# Altium schematic sheet Power Management.SchDoc
size A; SheetNumber: 4; SheetTotal: 7
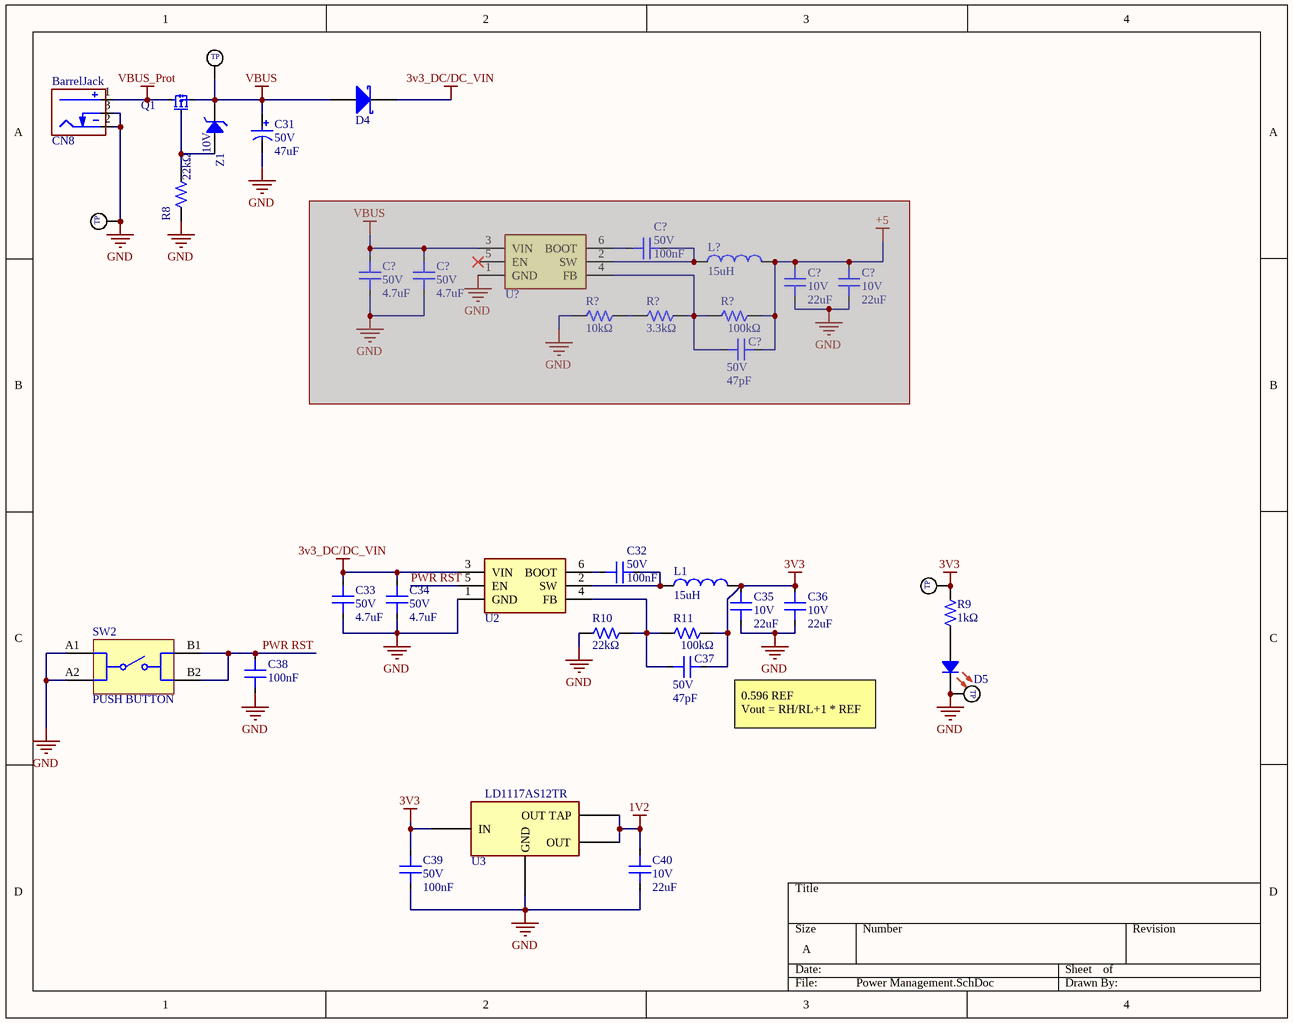
[diagram p0: Power Management.SchDoc]

## Parts
(Parts that share a designator on the sheet are numbered #1, #2 ... from top to bottom, then left to right.)
C31  Voltage Rating: 50V  Capacitance: 47uF  [CAP TH ALUM ELEC D6.30mm S2.50mm H11.00mm]  (hidden comment: CAP ALUM 47uF ±20% 50V TH)
C32  Voltage Rating: 50V  Capacitance: 100nF  [C_0603]  (hidden comment: CAP CER 100nF 50V X7R 0603)
C33  Voltage Rating: 50V  Capacitance: 4.7uF  [C_1206]  (hidden comment: CAP CER 4.7uF 50V X7R 1206)
C34  Voltage Rating: 50V  Capacitance: 4.7uF  [C_1206]  (hidden comment: CAP CER 4.7uF 50V X7R 1206)
C35  Voltage Rating: 10V  Capacitance: 22uF  [C_1206]  (hidden comment: CAP CER 22uF 10V X7R 1206)
C36  Voltage Rating: 10V  Capacitance: 22uF  [C_1206]  (hidden comment: CAP CER 22uF 10V X7R 1206)
C37  Voltage Rating: 50V  Capacitance: 47pF  [C_0603]  (hidden comment: CAP CER 47pF 50V C0G 0603)
C38  Capacitance: 100nF  [C_0603]  (hidden comment: CAP CER 100nF 50V X7R 0603)
C39  Voltage Rating: 50V  Capacitance: 100nF  [C_0603]  (hidden comment: CAP CER 100nF 50V X7R 0603)
C40  Voltage Rating: 10V  Capacitance: 22uF  [C_1206]  (hidden comment: CAP CER 22uF 10V X7R 1206)
C?#1  Voltage Rating: 50V  Capacitance: 100nF  [C_0603]  (hidden comment: CAP CER 100nF 50V X7R 0603)  (masked out: inside a compile mask, not in the netlist)
C?#2  Voltage Rating: 50V  Capacitance: 4.7uF  [C_1206]  (hidden comment: CAP CER 4.7uF 50V X7R 1206)  (masked out: inside a compile mask, not in the netlist)
C?#3  Voltage Rating: 50V  Capacitance: 4.7uF  [C_1206]  (hidden comment: CAP CER 4.7uF 50V X7R 1206)  (masked out: inside a compile mask, not in the netlist)
C?#4  Voltage Rating: 10V  Capacitance: 22uF  [C_1206]  (hidden comment: CAP CER 22uF 10V X7R 1206)  (masked out: inside a compile mask, not in the netlist)
C?#5  Voltage Rating: 10V  Capacitance: 22uF  [C_1206]  (hidden comment: CAP CER 22uF 10V X7R 1206)  (masked out: inside a compile mask, not in the netlist)
C?#6  Voltage Rating: 50V  Capacitance: 47pF  [C_0603]  (hidden comment: CAP CER 47pF 50V C0G 0603)  (masked out: inside a compile mask, not in the netlist)
CN8  CONN PWR JACK 2mm x 6.4mm TH R/A  [CONN_DC-POWER-JACK_TH_RA]  (value not drawn)
D4  DIODE SCHOTTKY 40V SOD-323  [SOD323]  (value not drawn)
D5  LED RED WATER CLEAR 0603 SMD  [LED_0603]  (value not drawn)
L1  Inductance: 15uH  [IND_SMD,4.7X4.7MM]  (hidden comment: FIXED IND 15uH 0.76A 149mΩ SMD,4.7x4.7mm)
L?  Inductance: 15uH  [IND_SMD,4.7X4.7MM]  (hidden comment: FIXED IND 15uH 0.76A 149mΩ SMD,4.7x4.7mm)  (masked out: inside a compile mask, not in the netlist)
Q1  MOSFET P-CH 30V 4A SOT-23  [SOT23]  (value not drawn)
R8  Resistance: 22kΩ  [R_0603]  (hidden comment: RES 22kΩ ±1% 100mW 0603)
R9  Resistance: 1kΩ  [R_0603]  (hidden comment: RES 1kΩ ±1% 100mW 0603)
R10  Resistance: 22kΩ  [R_0603]  (hidden comment: RES 22kΩ ±1% 100mW 0603)
R11  Resistance: 100kΩ  [R_0603]  (hidden comment: RES 100kΩ ±1% 100mW 0603)
R?#1  Resistance: 10kΩ  [R_0603]  (hidden comment: RES 10kΩ ±1% 100mW 0603)  (masked out: inside a compile mask, not in the netlist)
R?#2  Resistance: 3.3kΩ  [R_0603]  (hidden comment: RES 3.3kΩ ±1% 100mW 0603)  (masked out: inside a compile mask, not in the netlist)
R?#3  Resistance: 100kΩ  [R_0603]  (hidden comment: RES 100kΩ ±1% 100mW 0603)  (masked out: inside a compile mask, not in the netlist)
SW2  PUSH BUTTON  [Tact Switch 6X6X9.5MM]
TP1  TestPoint TH  [TESTPOINT_TH_MINIATURE]  (value not drawn)
TP2  TestPoint TH  [TESTPOINT_TH_MINIATURE]  (value not drawn)
TP3  TestPoint TH  [TESTPOINT_TH_MINIATURE]  (value not drawn)
TP4  TestPoint TH  [TESTPOINT_TH_MINIATURE]  (value not drawn)
U2  4.5-V to 28-V Input, 3-A Output, EMI-Friendly Synchronous Step-Down Converter  [TSOT-23-6]  (value not drawn)
U3  Low Dropout Fixed and Adjustable Positive Voltage Regulators  [SOT-223-4]  (value not drawn)
U?  4.5-V to 28-V Input, 3-A Output, EMI-Friendly Synchronous Step-Down Converter  [TSOT-23-6]  (value not drawn)  (masked out: inside a compile mask, not in the netlist)
Z1  Zener Voltage: 10V  [SOD123]  (hidden comment: DIODE ZENER 10V 500mW SOD-123)

## Nets
1V2: C40.2 U3.2(OUT) U3.4(OUT_TAP)
3V3: C35.2 C36.2 C37.2 C39.2 L1.2 R9.1 R11.2 TP3.1 U3.3(IN)
3v3_DC/DC_VIN: C33.1 C34.1 D4.2(K) U2.3(VIN)
GND: C31.2 C33.2 C34.2 C35.1 C36.1 C38.1 C39.1 C40.1 CN8.2(Outer) CN8.3(SW) D5.2 R8.1 R10.1 SW2.A1 SW2.A2 TP2.1 TP4.1 U2.1(GND) U3.1(GND)
VBUS: C31.1 D4.1(A) Q1.2(SOURCE) TP1.1 Z1.2
VBUS_Prot: CN8.1(Centre) Q1.3(DRAIN)
PWR RST: C38.2 SW2.B1 SW2.B2 U2.5(EN)
NetC32_1: C32.1 U2.6(BOOT)
NetC32_2: C32.2 L1.1 U2.2(SW)
NetC37_1: C37.1 R10.2 R11.1 U2.4(FB)
NetD5_1: D5.1 R9.2
NetQ1_1: Q1.1(GATE) R8.2 Z1.1

## Notes on the sheet
- 0.596 REF
  Vout = RH/RL+1 * REF
- (in symbol 5000) TP

## Library data of the parts
C31 = ERS1HM470E110T: 47uF 50V Aluminum Electrolytic Capacitors Through Hole,D6.3xL11mm 5000hrs@105℃; Manufacturer: AISHI; Symbol Path 1: Symbols\Standard.SchLib; Unit Price (USD): 0.0351; MPN: ERS1HM470E110T; LCSC Part #: C106665; Package: THROUGH HOLE,D6.3XL11MM; JLC Part Type: Extended; LCSC Stock: 162380; JLC Stock: 171488; MOQ: 20; Datasheet: https://datasheet.lcsc.com/datasheet/pdf/b0168805bce6925b8870af550341b247.pdf?productCode=C106665; URL: https://www.lcsc.com/product-detail/C106665.html; Status: ok; Tolerance: ±20%; Lifetime: 5000hrs@105℃; Subcategory: Aluminum Electrolytic Capacitors
C32 C39 C?#1 = C14663: 100nF ±10% 50V Ceramic Capacitor X7R 0603; Manufacturer: YAGEO; MPN: CC0603KRX7R9BB104; Symbol Path 1: Symbols\Standard.SchLib; Unit Price (USD): 0.0175; LCSC Part #: C14663; Package: 0603; JLC Part Type: Basic; LCSC Stock: 10701000; JLC Stock: 72739428; MOQ: 50; Datasheet: https://datasheet.lcsc.com/datasheet/pdf/23ccee80ee542e7cf156a772bb589942.pdf?productCode=C14663; URL: https://www.lcsc.com/product-detail/C14663.html; Status: ok; Tolerance: ±10%; TempCo: X7R
C33 C34 C?#2 C?#3 = C29823: 4.7uF ±10% 50V Ceramic Capacitor X7R 1206; Manufacturer: FH; MPN: 1206B475K500NT; Symbol Path 1: Symbols\Standard.SchLib; Unit Price (USD): 0.2723; LCSC Part #: C29823; Package: 1206; JLC Part Type: Basic; LCSC Stock: 428640; JLC Stock: 942034; MOQ: 10; Datasheet: https://datasheet.lcsc.com/datasheet/pdf/09fe2daf22580a99fa7fea93ccb20fb7.pdf?productCode=C29823; URL: https://www.lcsc.com/product-detail/C29823.html; Status: ok; Tolerance: ±10%; TempCo: X7R
C35 C36 C40 C?#4 C?#5 = C87996: 22uF ±10% 10V Ceramic Capacitor X7R 1206; Manufacturer: Samsung Electro-Mechanics; MPN: CL31B226KPHNNNE; Symbol Path 1: Symbols\Standard.SchLib; Unit Price (USD): 0.1794; LCSC Part #: C87996; Package: 1206; JLC Part Type: Extended; LCSC Stock: 223920; JLC Stock: 305356; MOQ: 5; Datasheet: https://datasheet.lcsc.com/datasheet/pdf/02336ea48ea44ca18c72517dd3cb7b47.pdf?productCode=C87996; URL: https://www.lcsc.com/product-detail/C87996.html; Status: ok; Tolerance: ±10%; TempCo: X7R
C37 C?#6 = C1671: 47pF ±5% 50V Ceramic Capacitor C0G 0603; Manufacturer: Samsung Electro-Mechanics; MPN: CL10C470JB8NNNC; Symbol Path 1: Symbols\Standard.SchLib; Unit Price (USD): 0.011; LCSC Part #: C1671; Package: 0603; JLC Part Type: Basic; LCSC Stock: 658700; JLC Stock: 1229214; MOQ: 100; Datasheet: https://datasheet.lcsc.com/datasheet/pdf/02336ea48ea44ca18c72517dd3cb7b47.pdf?productCode=C1671; URL: https://www.lcsc.com/product-detail/C1671.html; Status: ok; Tolerance: ±5%; TempCo: C0G
C38 = CC0603KRX7R9BB104: 100nF ±10% 50V Ceramic Capacitor X7R 0603; Manufacturer: YAGEO; Symbol Path 1: Symbols\Standard.SchLib; Unit Price (USD): 0.0175; Voltage Rating: 50V; MPN: CC0603KRX7R9BB104; LCSC Part #: C14663; Package: 0603; JLC Part Type: Basic; LCSC Stock: 10701000; JLC Stock: 72739428; MOQ: 50; Datasheet: https://datasheet.lcsc.com/datasheet/pdf/23ccee80ee542e7cf156a772bb589942.pdf?productCode=C14663; URL: https://www.lcsc.com/product-detail/C14663.html; Status: ok; Tolerance: ±10%; TempCo: X7R
CN8 = DC-005-A200: Power Barrel Connector Jack 2mm ID 6.4mm OD Through Hole, Right Angle; Manufacturer: XUNPU; Symbol Path 1: Symbols\Standard_CONN.SchLib; Unit Price (USD): 0.1442; MPN: DC-005-A200; LCSC Part #: C720557; Package: THROUGH HOLE; JLC Part Type: Extended; LCSC Stock: 71145; JLC Stock: 71145; MOQ: 5; Datasheet: https://datasheet.lcsc.com/datasheet/pdf/c2acc7caa29ac1d040564d55b702c9cb.pdf?productCode=C720557; URL: https://www.lcsc.com/product-detail/C720557.html; Status: ok
D4 = 1N5819WS: Diode 40V 1A Surface Mount SOD-323; Manufacturer: Guangdong Hottech; Symbol Path 1: Symbols\Standard.SchLib; Unit Price (USD): 0.0139; Forward Voltage: 600mV@1A; MPN: 1N5819WS; LCSC Part #: C191023; Package: SOD-323; JLC Part Type: Basic; LCSC Stock: 4984450; JLC Stock: 5626571; MOQ: 50; Datasheet: https://datasheet.lcsc.com/datasheet/pdf/c7a6590686b7be2f86b8eed4480e569c.pdf?productCode=C191023; URL: https://www.lcsc.com/product-detail/C191023.html; Status: ok; Voltage Rating: 40V; Current Rating: 1A; Subcategory: Schottky
D5 = XL-1608SURC-06: Red 625nm LED Indication - Discrete 2.3V 0603; Manufacturer: XINGLIGHT; Symbol Path 1: Symbols\Standard.SchLib; Unit Price (USD): 0.0035; Forward Current: 20mA; Luminous: 225mcd; MPN: XL-1608SURC-06; LCSC Part #: C965799; Package: 0603; JLC Part Type: Extended; LCSC Stock: 7400800; JLC Stock: 7400861; MOQ: 100; Datasheet: https://datasheet.lcsc.com/datasheet/pdf/8b84af6e65674f776ac713f2807c626a.pdf?productCode=C965799; URL: https://www.lcsc.com/product-detail/C965799.html; Status: ok; Colour: Red; Forward Voltage: 2.3V
L1 L? = XRRH4D28-150M: Manufacturer: XR; Symbol Path 1: Symbols\Standard.SchLib; Unit Price (USD): 0.1057; Tolerance: ±20%; Rated Current: 760mA; MPN: XRRH4D28-150M; LCSC Part #: C5351438; Package: SMD,4.7X4.7MM; JLC Part Type: Extended; LCSC Stock: 640; JLC Stock: 640; MOQ: 5; Datasheet: https://datasheet.lcsc.com/datasheet/pdf/86c679cf93a94dd1d57823f3427e60b9.pdf?productCode=C5351438; URL: https://www.lcsc.com/product-detail/C5351438.html; Status: ok; DC Resistance: 149mΩ
Q1 = AO3401A: 30V 4A Surface Mount SOT-23; Manufacturer: AOS; Symbol Path 1: Symbols\Standard.SchLib; Unit Price (USD): 0.0951; Rds: 47mΩ@10V;60mΩ@4.5V;85mΩ@2.5V; Vgs(th): 900mV; MPN: AO3401A; LCSC Part #: C15127; Package: SOT-23; JLC Part Type: Basic; LCSC Stock: 115510; JLC Stock: 469891; MOQ: 5; Datasheet: https://datasheet.lcsc.com/datasheet/pdf/fee353dd1e9e0bc90b295f14f381aa4c.pdf?productCode=C15127; URL: https://www.lcsc.com/product-detail/C15127.html; Status: ok; Vds: 30V; Id: 4A
R8 R10 = C31850: 22kΩ ±1% 100mW 0603 Thick Film Resistor; MPN: 0603WAF2202T5E; Manufacturer: UNI-ROYAL; Symbol Path 1: Symbols\Standard.SchLib; Unit Price (USD): 0.0067; Voltage Rating: 75V; TempCo: ±100ppm/℃; LCSC Part #: C31850; Package: 0603; Datasheet: https://datasheet.lcsc.com/datasheet/pdf/0a975aaa49b7c97f38a963127be4a823.pdf?productCode=C31850; Power: 100mW; JLC Part Type: Basic; LCSC Stock: 3044300; JLC Stock: 4293246; MOQ: 100; URL: https://www.lcsc.com/product-detail/C31850.html; Status: ok; Tolerance: ±1%; Composition: Thick Film Resistor
R9 = 0603WAF1001T5E: 1kΩ ±1% 100mW 0603 Thick Film Resistor; Manufacturer: UNI-ROYAL; Symbol Path 1: Symbols\Standard.SchLib; Unit Price (USD): 0.0058; Voltage Rating: 75V; TempCo: ±100ppm/℃; MPN: 0603WAF1001T5E; Package: 0603; Datasheet: https://datasheet.lcsc.com/datasheet/pdf/0a975aaa49b7c97f38a963127be4a823.pdf?productCode=C21190; Power: 100mW; LCSC Part #: C21190; JLC Part Type: Basic; LCSC Stock: 7626000; JLC Stock: 31254885; MOQ: 100; URL: https://www.lcsc.com/product-detail/C21190.html; Status: ok; Tolerance: ±1%; Composition: Thick Film Resistor
R11 R?#3 = C25803: 100kΩ ±1% 100mW 0603 Thick Film Resistor; MPN: 0603WAF1003T5E; Manufacturer: UNI-ROYAL; Symbol Path 1: Symbols\Standard.SchLib; Unit Price (USD): 0.0042; Voltage Rating: 75V; TempCo: ±100ppm/℃; LCSC Part #: C25803; Package: 0603; Datasheet: https://datasheet.lcsc.com/datasheet/pdf/0a975aaa49b7c97f38a963127be4a823.pdf?productCode=C25803; Power: 100mW; JLC Part Type: Basic; LCSC Stock: 13059500; JLC Stock: 21549170; MOQ: 100; URL: https://www.lcsc.com/product-detail/C25803.html; Status: ok; Tolerance: ±1%; Composition: Thick Film Resistor
R?#1 = 0603WAF1002T5E: 10kΩ ±1% 100mW 0603 Thick Film Resistor; Manufacturer: UNI-ROYAL; Symbol Path 1: Symbols\Standard.SchLib; Unit Price (USD): 0.0067; Voltage Rating: 75V; TempCo: ±100ppm/℃; MPN: 0603WAF1002T5E; Package: 0603; Datasheet: https://datasheet.lcsc.com/datasheet/pdf/0a975aaa49b7c97f38a963127be4a823.pdf?productCode=C25804; Power: 100mW; LCSC Part #: C25804; JLC Part Type: Basic; LCSC Stock: 0; JLC Stock: 6329063; MOQ: 100; URL: https://www.lcsc.com/product-detail/C25804.html; Status: ok; Tolerance: ±1%; Composition: Thick Film Resistor
R?#2 = 0603WAF3301T5E: 3.3kΩ ±1% 100mW 0603 Thick Film Resistor; Manufacturer: UNI-ROYAL; Symbol Path 1: Symbols\Standard.SchLib; Unit Price (USD): 0.005; Voltage Rating: 75V; TempCo: ±100ppm/℃; MPN: 0603WAF3301T5E; Package: 0603; Datasheet: https://datasheet.lcsc.com/datasheet/pdf/0a975aaa49b7c97f38a963127be4a823.pdf?productCode=C22978; Power: 100mW; LCSC Part #: C22978; JLC Part Type: Basic; LCSC Stock: 4987900; JLC Stock: 7018614; MOQ: 100; URL: https://www.lcsc.com/product-detail/C22978.html; Status: ok; Tolerance: ±1%; Composition: Thick Film Resistor
SW2 = SH-6X6X8H-CJ: SWITCH PUSH BUTTON 2X2 6X6X9.5MM; Supplier 1: LCSC; Supplier Part Number 1: C42416249; ComponentLink1Description: MAKERS; ComponentLink1URL: https://makerselectronics.com/product/mini-push-button-4-pin-6x6x9-5mm
TP1-TP4 = 5000: TestPoint TH MINIATURE; Supplier 1: Digikey; Supplier Part Number 1: 36-5000-ND; Supplier 2: LCSC; Supplier Part Number 2: C5277086
U2 U? = TPS54302DDCR: Buck Switching Regulator IC Adjustable 1 Output 3A TSOT-23-6; Manufacturer: TI; Symbol Path 1: Symbols\Standard_ICs.SchLib; Unit Price (USD): 0.3033; Input Voltage: 4.5V~28V; MPN: TPS54302DDCR; LCSC Part #: C311983; Package: TSOT-23-6; JLC Part Type: Extended; LCSC Stock: 4335; JLC Stock: 5216; MOQ: 5; Datasheet: https://datasheet.lcsc.com/datasheet/pdf/dd7a4984f2d3ca9a2264b937537aa471.pdf?productCode=C311983; URL: https://www.lcsc.com/product-detail/C311983.html; Status: ok; Subcategory: Voltage Regulators - DC DC Switching Regulators; Output Current: 3A
U3 = LD1117AS12TR: Manufacturer: ST; Symbol Path 1: Symbols\Standard_ICs.SchLib; Unit Price (USD): 0.3055; Output Voltage: 1.2V; Output Current: 1.2A; Input Voltage: 10V; MPN: LD1117AS12TR; LCSC Part #: C98193; Package: SOT-223; JLC Part Type: Extended; LCSC Stock: 2645; JLC Stock: 2647; MOQ: 5; Datasheet: https://datasheet.lcsc.com/datasheet/pdf/bad2b7c9a0104f7f93b9ca5f4bf0c704.pdf?productCode=C98193; URL: https://www.lcsc.com/product-detail/C98193.html; Status: ok; Subcategory: Voltage Regulators - Linear, Low Drop Out (LDO) Regulators
Z1 = MM1Z10B: Zener Diode Independent 10V 500mW Surface Mount SOD-123; Manufacturer: R+O; Symbol Path 1: Symbols\Standard.SchLib; Unit Price (USD): 0.0253; MPN: MM1Z10B; LCSC Part #: C22466341; Package: SOD-123; JLC Part Type: Extended; LCSC Stock: 58240; JLC Stock: 58248; MOQ: 20; Datasheet: https://datasheet.lcsc.com/datasheet/pdf/907cba31244dca3d738fcc4264c58834.pdf?productCode=C22466341; URL: https://www.lcsc.com/product-detail/C22466341.html; Status: ok; Subcategory: Zener